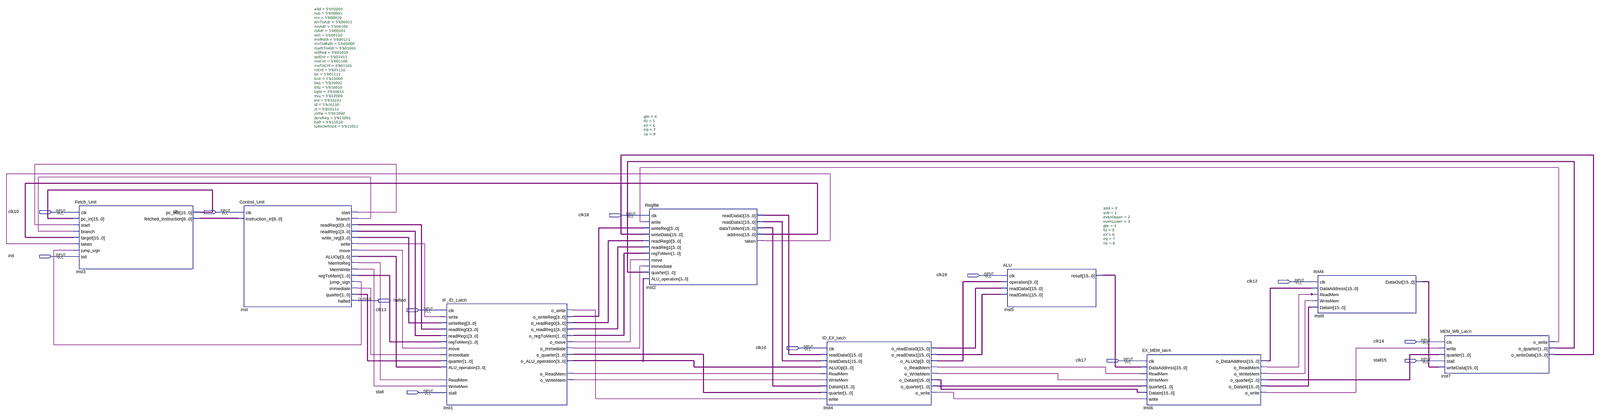
[diagram p0: schematic sheet, whole]
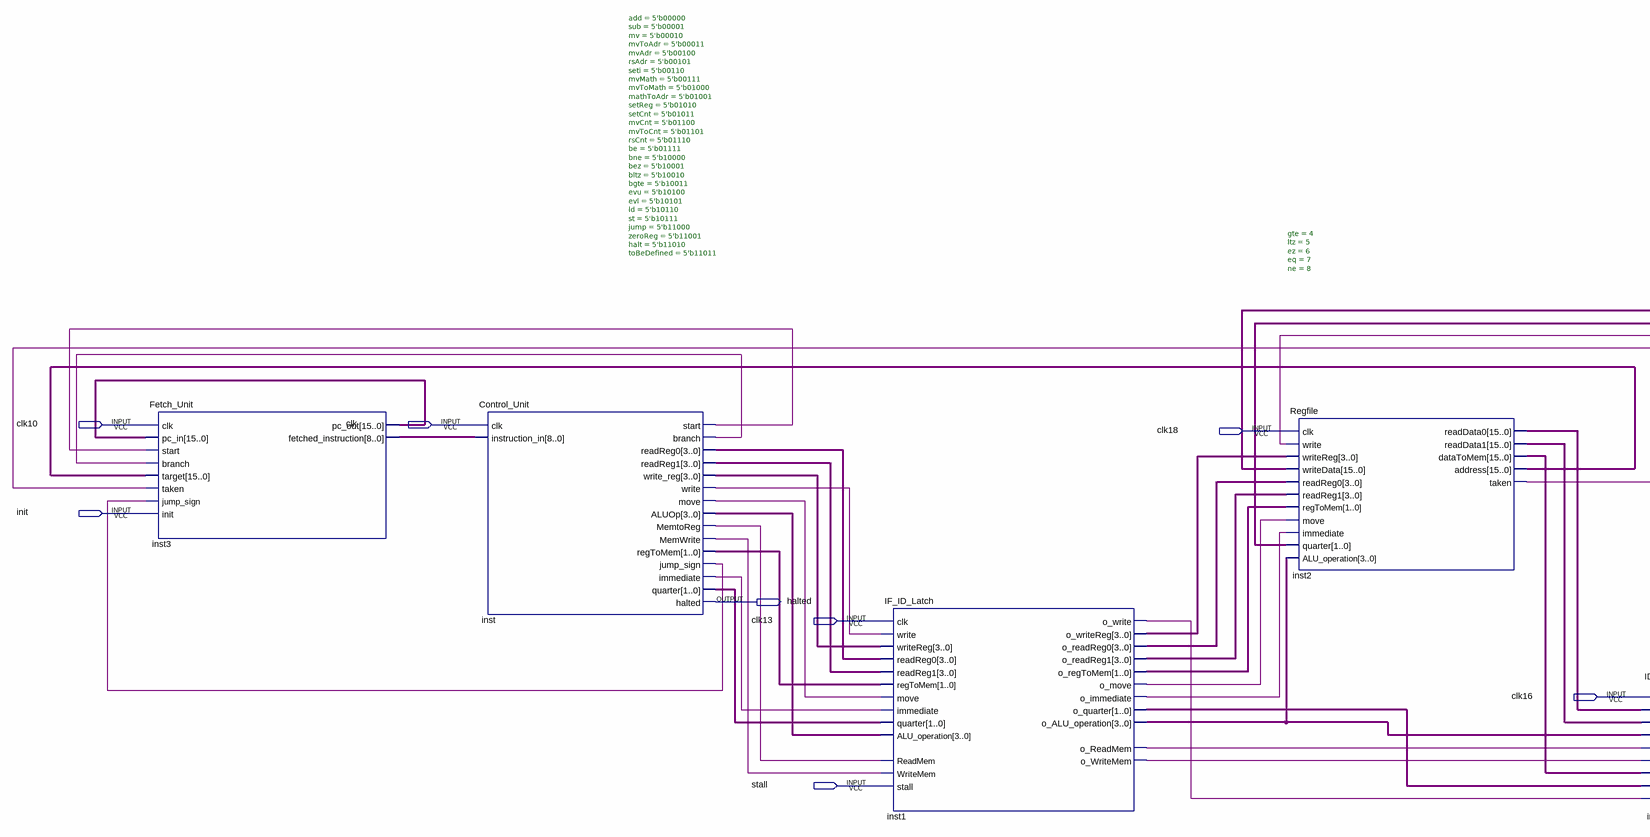
[diagram p1: schematic sheet, left part]
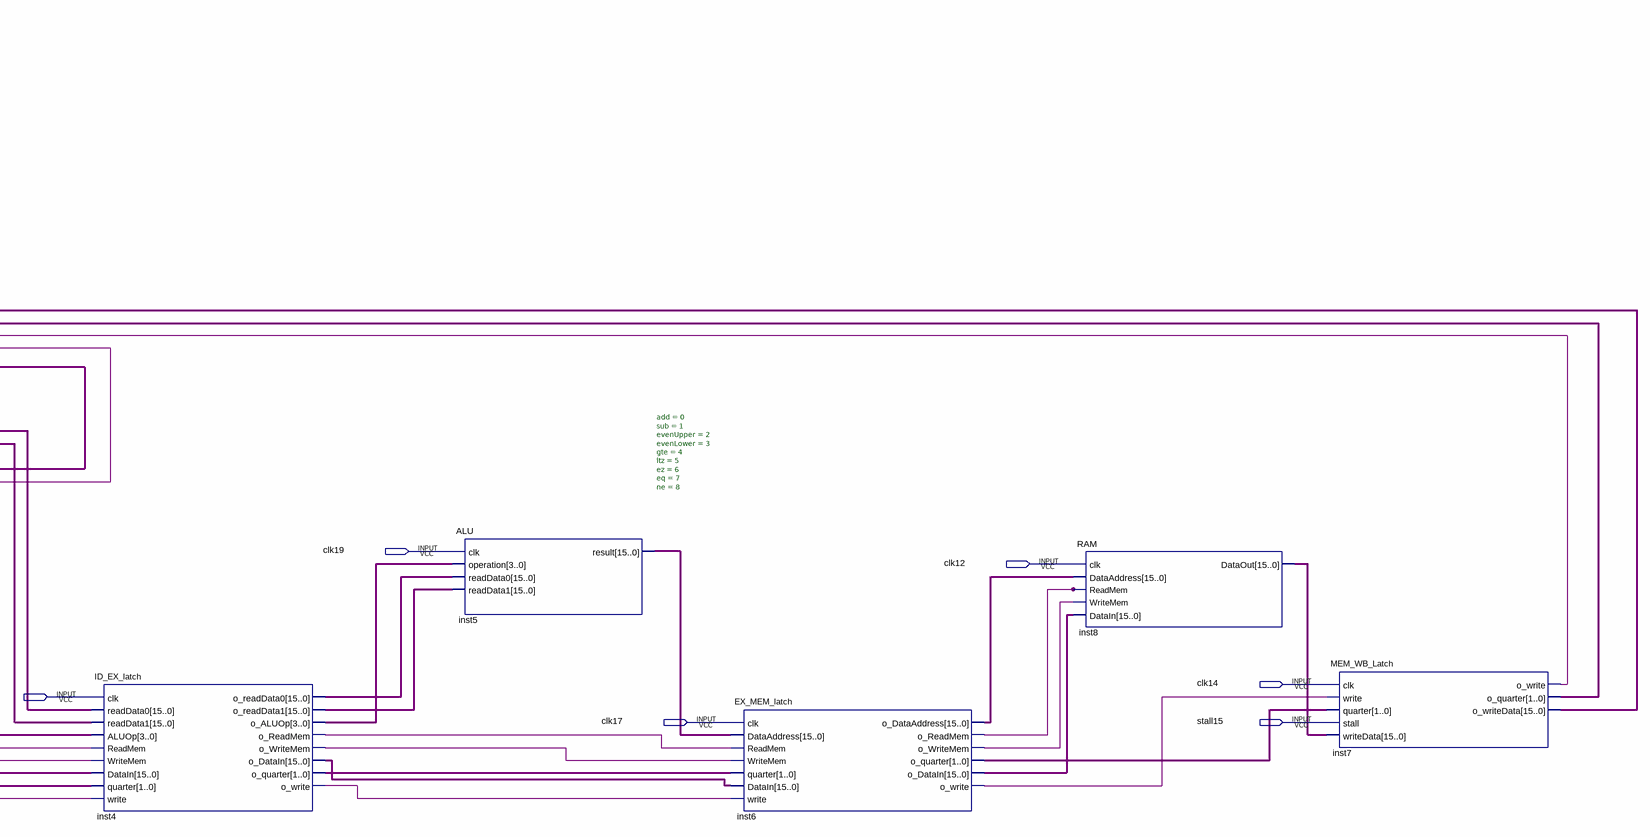
[diagram p2: schematic sheet, right part]
// Quartus schematic Pipelined_CPU.bdf as structural Verilog: 9 symbols, 13 pins
module Pipelined_CPU (
  input  clk10,
  input  clk,
  input  clk18,
  input  init,
  input  clk19,
  input  clk12,
  input  clk13,
  input  clk14,
  input  clk16,
  input  clk17,
  input  stall15,
  input  stall,
  output halted
);

  wire inst1_o_immediate, inst1_o_move, inst1_o_readmem, inst1_o_write, inst1_o_writemem, inst2_taken,
       inst4_o_readmem, inst4_o_write, inst4_o_writemem, inst6_o_readmem, inst6_o_write, inst6_o_writemem,
       inst7_o_write, inst_branch, inst_immediate, inst_jump_sign, inst_memtoreg, inst_memwrite, inst_move,
       inst_start, inst_write;
  wire [1:0] inst1_o_quarter, inst1_o_regtomem, inst4_o_quarter, inst6_o_quarter, inst7_o_quarter,
       inst_quarter, inst_regtomem;
  wire [3:0] inst1_o_alu_operation, inst1_o_readreg0, inst1_o_readreg1, inst1_o_writereg, inst4_o_aluop,
       inst_aluop, inst_readreg0, inst_readreg1, inst_write_reg;
  wire [8:0] inst3_fetched_instruction;
  wire [15:0] inst2_address, inst2_datatomem, inst2_readdata0, inst2_readdata1, inst3_pc_out, inst4_o_datain,
       inst4_o_readdata0, inst4_o_readdata1, inst5_result, inst6_o_dataaddress, inst6_o_datain,
       inst7_o_writedata, inst8_dataout;

  Fetch_Unit inst3 (
    .clk(clk10), .pc_in(inst3_pc_out), .start(inst_start), .branch(inst_branch), .target(inst2_address),
    .taken(inst2_taken), .jump_sign(inst_jump_sign), .init(init), .pc_out(inst3_pc_out),
    .fetched_instruction(inst3_fetched_instruction));
  Control_Unit #(.add(5'b00000), .sub(5'b00001), .mv(5'b00010), .mvToAdr(5'b00011), .mvAdr(5'b00100), .rsAdr(5'b00101), .seti(5'b00110), .mvMath(5'b00111), .mvToMath(5'b01000), .mathToAdr(5'b01001), .setReg(5'b01010), .setCnt(5'b01011), .mvCnt(5'b01100), .mvToCnt(5'b01101), .rsCnt(5'b01110), .be(5'b01111), .bne(5'b10000), .bez(5'b10001), .bltz(5'b10010), .bgte(5'b10011), .evu(5'b10100), .evl(5'b10101), .ld(5'b10110), .st(5'b10111), .jump(5'b11000), .zeroReg(5'b11001), .halt(5'b11010), .toBeDefined(5'b11011)) inst (
    .clk(clk), .instruction_in(inst3_fetched_instruction), .start(inst_start), .branch(inst_branch),
    .readReg0(inst_readreg0), .readReg1(inst_readreg1), .write_reg(inst_write_reg), .write(inst_write),
    .move(inst_move), .ALUOp(inst_aluop), .MemtoReg(inst_memtoreg), .MemWrite(inst_memwrite),
    .regToMem(inst_regtomem), .jump_sign(inst_jump_sign), .immediate(inst_immediate), .quarter(inst_quarter),
    .halted(halted));
  IF_ID_Latch inst1 (
    .clk(clk13), .write(inst_write), .writeReg(inst_write_reg), .readReg0(inst_readreg0),
    .readReg1(inst_readreg1), .regToMem(inst_regtomem), .move(inst_move), .immediate(inst_immediate),
    .quarter(inst_quarter), .ALU_operation(inst_aluop), .ReadMem(inst_memtoreg), .WriteMem(inst_memwrite),
    .stall(stall), .o_write(inst1_o_write), .o_writeReg(inst1_o_writereg), .o_readReg0(inst1_o_readreg0),
    .o_readReg1(inst1_o_readreg1), .o_regToMem(inst1_o_regtomem), .o_move(inst1_o_move),
    .o_immediate(inst1_o_immediate), .o_quarter(inst1_o_quarter), .o_ALU_operation(inst1_o_alu_operation),
    .o_ReadMem(inst1_o_readmem), .o_WriteMem(inst1_o_writemem));
  Regfile #(.gte(4), .ltz(5), .ez(6), .eq(7), .ne(8)) inst2 (
    .clk(clk18), .write(inst7_o_write), .writeReg(inst1_o_writereg), .writeData(inst7_o_writedata),
    .readReg0(inst1_o_readreg0), .readReg1(inst1_o_readreg1), .regToMem(inst1_o_regtomem),
    .move(inst1_o_move), .immediate(inst1_o_immediate), .quarter(inst7_o_quarter),
    .ALU_operation(inst1_o_alu_operation), .readData0(inst2_readdata0), .readData1(inst2_readdata1),
    .dataToMem(inst2_datatomem), .address(inst2_address), .taken(inst2_taken));
  ID_EX_latch inst4 (
    .clk(clk16), .readData0(inst2_readdata0), .readData1(inst2_readdata1), .ALUOp(inst1_o_alu_operation),
    .ReadMem(inst1_o_readmem), .WriteMem(inst1_o_writemem), .DataIn(inst2_datatomem),
    .quarter(inst1_o_quarter), .write(inst1_o_write), .o_readData0(inst4_o_readdata0),
    .o_readData1(inst4_o_readdata1), .o_ALUOp(inst4_o_aluop), .o_ReadMem(inst4_o_readmem),
    .o_WriteMem(inst4_o_writemem), .o_DataIn(inst4_o_datain), .o_quarter(inst4_o_quarter),
    .o_write(inst4_o_write));
  ALU #(.add(0), .sub(1), .evenUpper(2), .evenLower(3), .gte(4), .ltz(5), .ez(6), .eq(7), .ne(8)) inst5 (
    .clk(clk19), .operation(inst4_o_aluop), .readData0(inst4_o_readdata0), .readData1(inst4_o_readdata1),
    .result(inst5_result));
  EX_MEM_latch inst6 (
    .clk(clk17), .DataAddress(inst5_result), .ReadMem(inst4_o_readmem), .WriteMem(inst4_o_writemem),
    .quarter(inst4_o_quarter), .DataIn(inst4_o_datain), .write(inst4_o_write),
    .o_DataAddress(inst6_o_dataaddress), .o_ReadMem(inst6_o_readmem), .o_WriteMem(inst6_o_writemem),
    .o_quarter(inst6_o_quarter), .o_DataIn(inst6_o_datain), .o_write(inst6_o_write));
  RAM inst8 (
    .clk(clk12), .DataAddress(inst6_o_dataaddress), .ReadMem(inst6_o_readmem), .WriteMem(inst6_o_writemem),
    .DataIn(inst6_o_datain), .DataOut(inst8_dataout));
  MEM_WB_Latch inst7 (
    .clk(clk14), .write(inst6_o_write), .quarter(inst6_o_quarter), .stall(stall15),
    .writeData(inst8_dataout), .o_write(inst7_o_write), .o_quarter(inst7_o_quarter),
    .o_writeData(inst7_o_writedata));
endmodule
